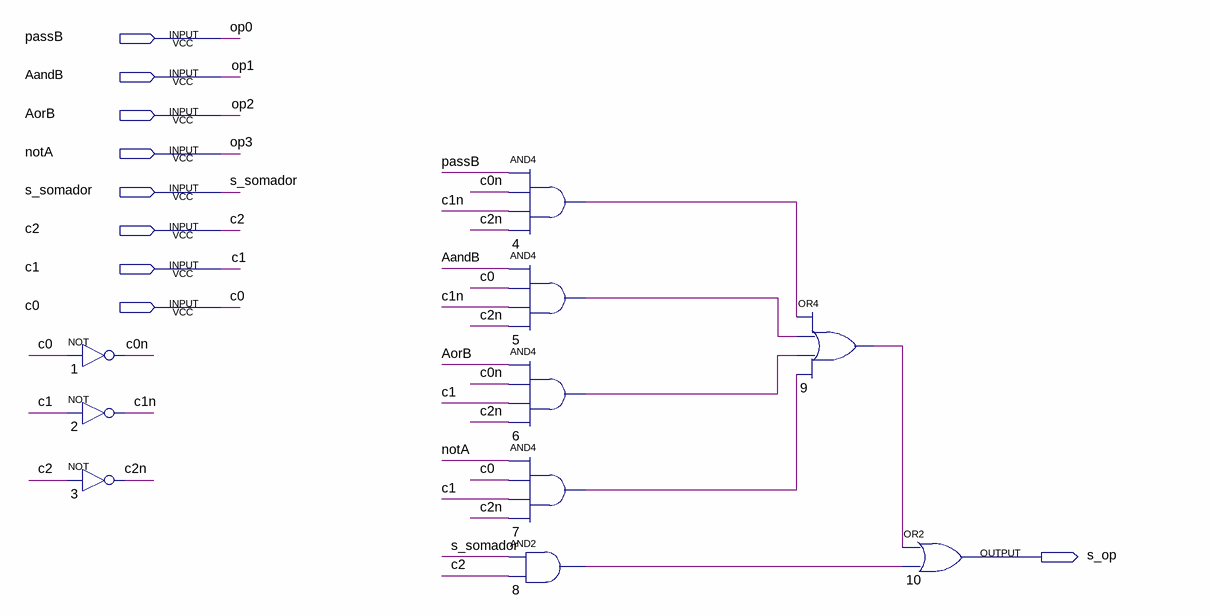
[diagram p0: schematic sheet]
// Quartus schematic mux_resultados.bdf as structural Verilog: 10 symbols, 9 pins
module mux_resultados (
  input  passB,
  input  AandB,
  input  AorB,
  input  notA,
  input  s_somador,
  input  c2,
  input  c1,
  input  c0,
  output s_op
);

  wire c0n, c1n, c2n, n4_out, n5_out, n6_out, n7_out, n8_out, n9_out;

  not u_1 (c0n, c0);
  not u_2 (c1n, c1);
  not u_3 (c2n, c2);
  and u_4 (n4_out, passB, c0n, c1n, c2n);
  and u_5 (n5_out, AandB, c0, c1n, c2n);
  and u_6 (n6_out, AorB, c0n, c1, c2n);
  and u_7 (n7_out, notA, c0, c1, c2n);
  and u_8 (n8_out, s_somador, c2);
  or u_9 (n9_out, n4_out, n5_out, n6_out, n7_out);
  or u_10 (s_op, n9_out, n8_out);

  // Other names for the same wires on the sheet: op0 = passB; op1 = AandB; op2 = AorB; op3 = notA
endmodule
